# EasyEDA schematic SCH_claprelay_2025-04-26.json
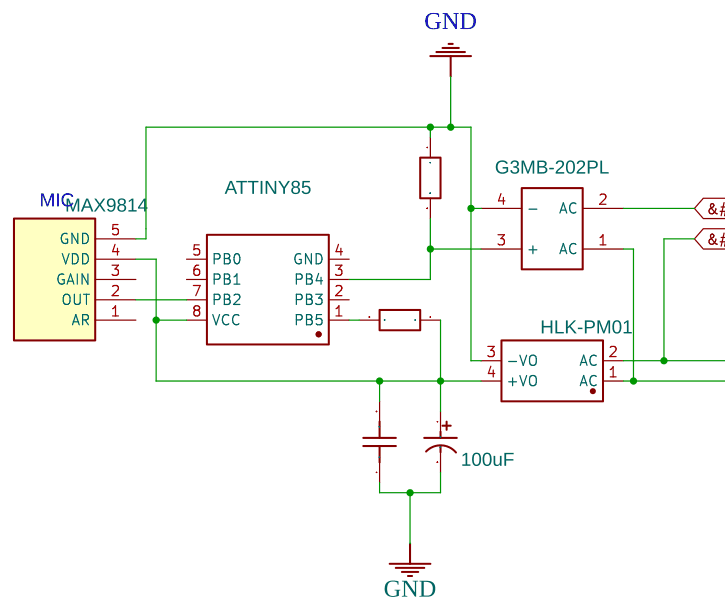
[diagram p0: schematic sheet]

## Parts
C3  100nF  [CAP-TH_L4.0-W2.5-P5.00-D0.5]
C4  100uF  [CAP-TH_BD5.0-P2.00-D0.8-FD]
K2  G3MB-202PL  [RELAY-TH_G3MB-202PL]
R3  10k  [RES-TH_BD2.3-L6.5-P10.50-D0.5]
R4  10k  [RES-TH_BD2.3-L6.5-P10.50-D0.5]
U4  MAX9814  [MAX9814 MODULE]
U6  HLK-PM01  [PWRM-TH_HLK-PM01]
U7  ATTINY85  [SOIC-8_L5.3-W5.3-P1.27-LS8.0-BL]

## Library data of the parts
C3 = RDER71E104K0M1H03A: Supplier: LCSC; Supplier Part: C1622116; Manufacturer: muRata(村田); Contributor: LCSC; JLCPCB Part Class: Extended Part
C4 = KF101M016C110A: Supplier: LCSC; Manufacturer: CapXon; Supplier Part: C59317; JLCPCB Part Class: Extended Part
K2 = G3MB-202PL: Supplier: LCSC; Manufacturer: OMRON; Supplier Part: C48654; JLCPCB Part Class: Extended Part
R3 R4 = MF1/4W-470KΩ±1%T52: Supplier: LCSC; Supplier Part: C714046; Manufacturer: Huaxing Mechanical-Elec.; Contributor: LCSC; Resistance: 470kΩ; JLCPCB Part Class: Extended Part
U4 = MAX9814 MODULE: link: https://www.aliexpress.com/item/32863198849.html?spm=a2g0o.productlist.0.0.1ef63176b8jnjL&algo_pvid=ad838478-78d5-4871-854d-3ec2c57660a3&algo_expid=ad838478-78d5-4871-854d-3ec2c57660a3-2&btsid=2dc5fa8a-3cc7-4c9a-afff-a62310840b60&ws_ab_test=searchweb0_0,searchweb201602_8,searchweb201603_53; Contributor: Ralc
U6 = HLK-PM01: Supplier: LCSC; Supplier Part: C209903; Manufacturer: HI-LINK; Contributor: LCSC; JLCPCB Part Class: Extended Part
U7 = ATTINY85V-10SUR: Supplier: LCSC; Supplier Part: C616065; Manufacturer: MICROCHIP(美国微芯); Contributor: LCSC

## Nets
GND: C3.1 C4.2 K2.4(-) R3.1 U4.5(GND) U6.3(-VO)
&#126;220V-0: U6.2(AC)
&#126;220V-1: K2.1(AC) U6.1(AC)
&#126;LOAD0: K2.2(AC)
Net-(C3-2): C3.2 C4.1 R4.1 U4.4(VDD) U6.4(+VO) U7.8(VCC)
Net-(K2-3): K2.3(+) R3.2 U7.3(PB4)
Net-(R4-2): R4.2 U7.1(PB5)
Net-(U4-2): U4.2(OUT) U7.7(PB2)

Not connected (* = marked no-connect by the designer): U4 1(AR) 3(GAIN); U7 2(PB3) 4(GND) 5(PB0) 6(PB1)

## Notes on the sheet
- MIC
